# EAGLE design quad_train_detector (EAGLE 4.16)
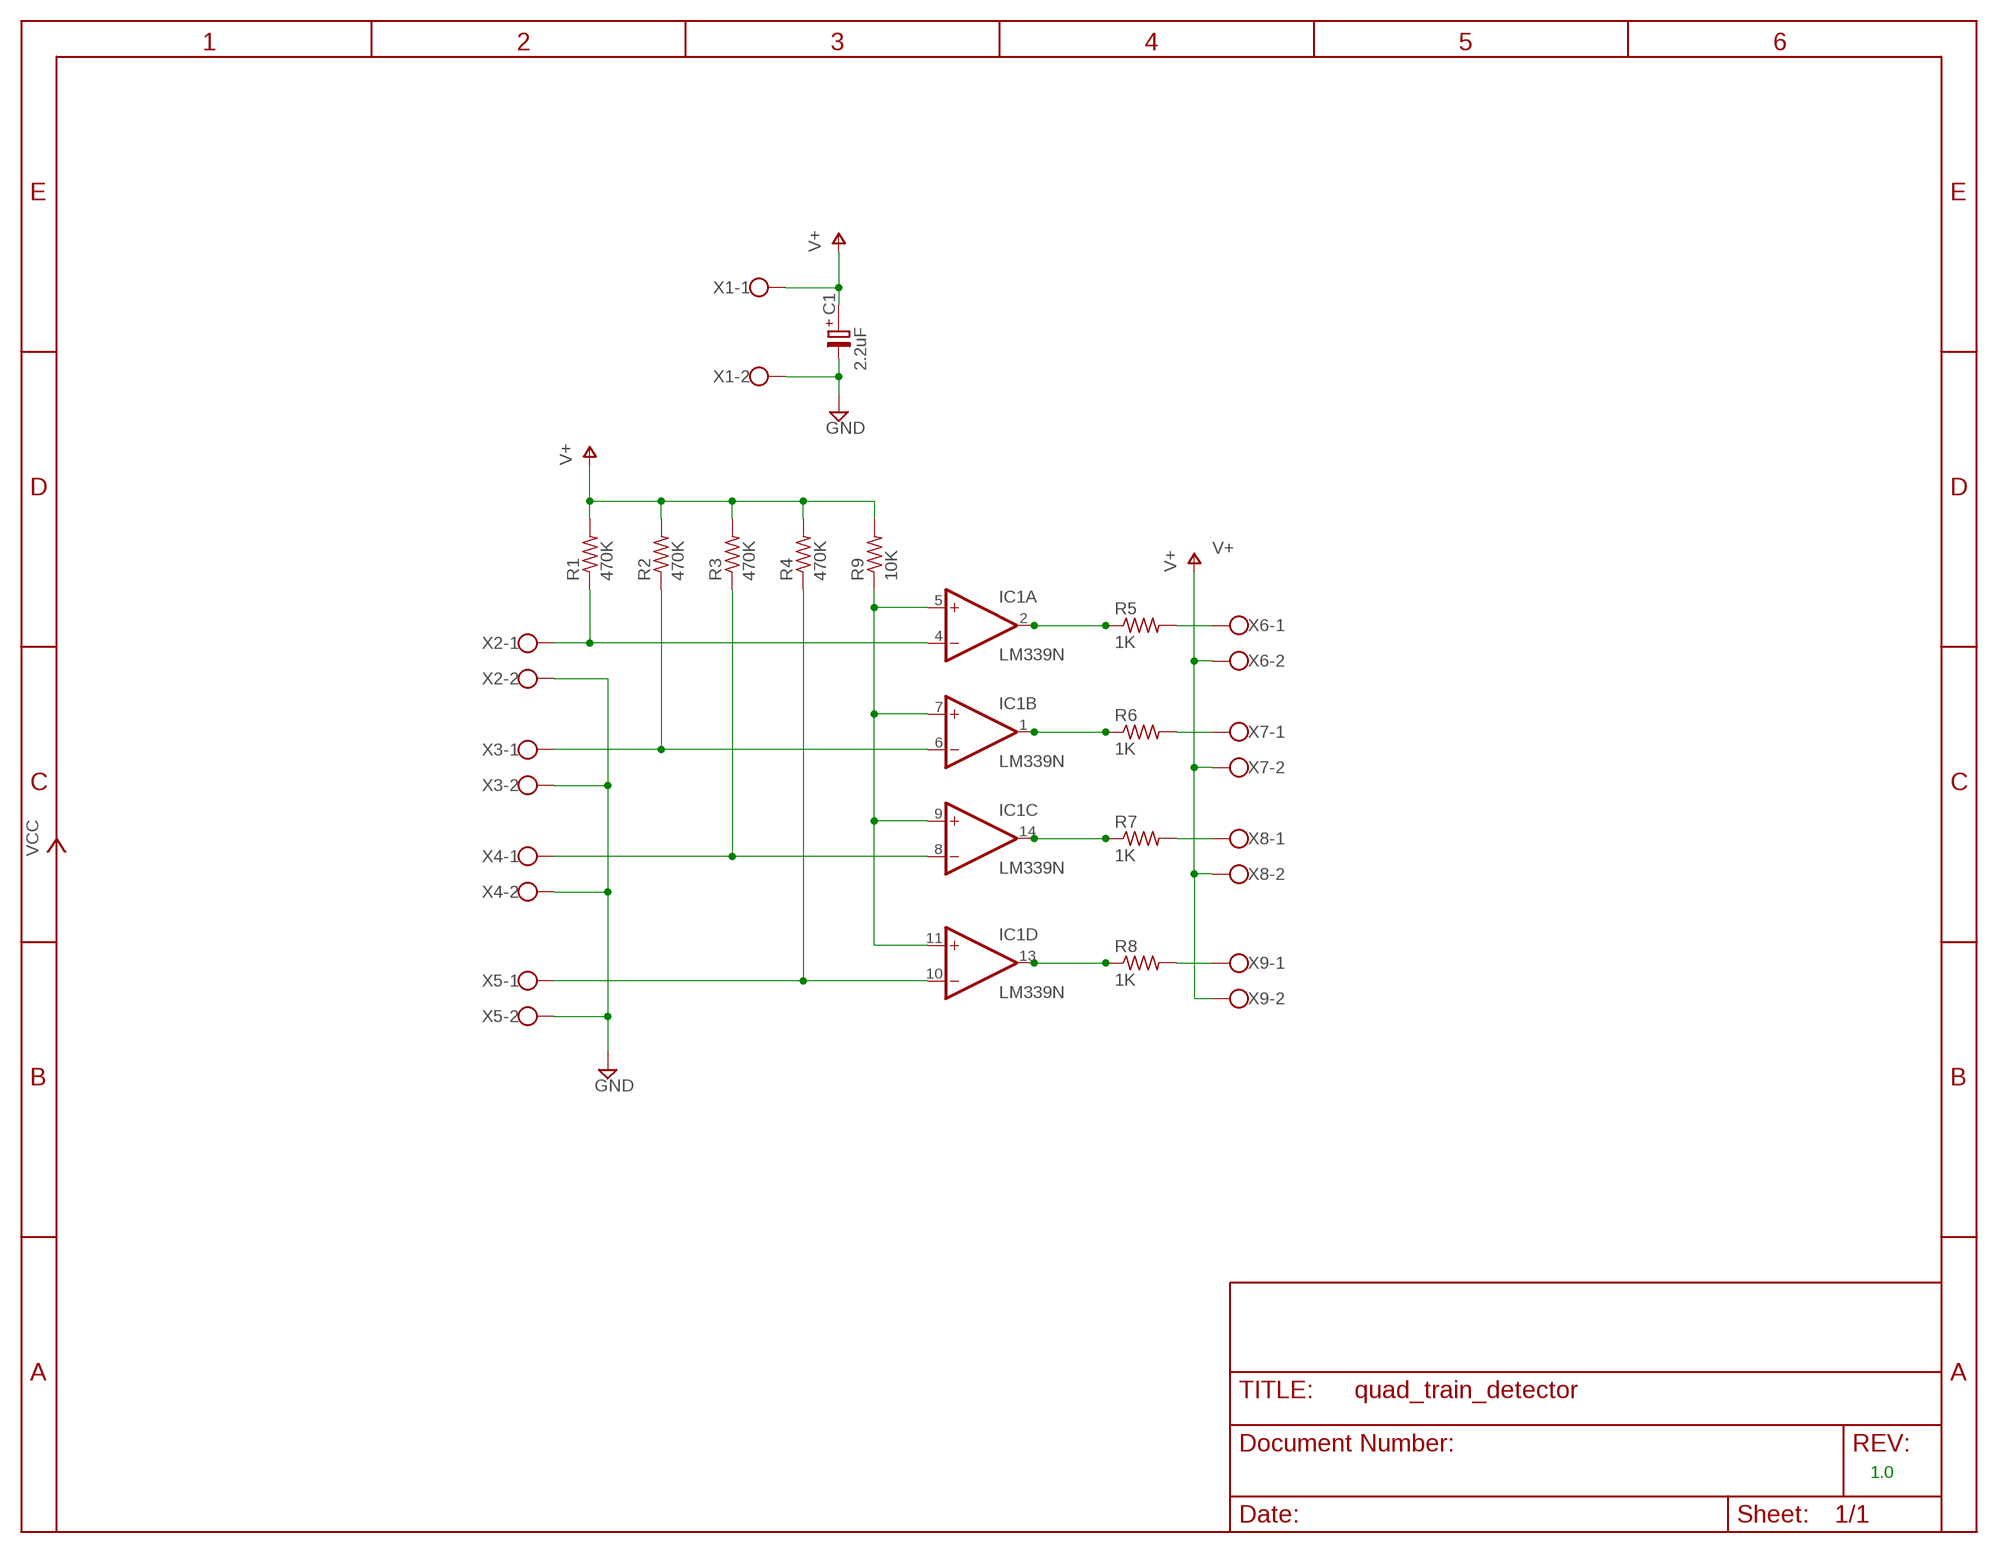
[diagram p0: schematic, sheet 1]

## Parts
C1  2.2uF  C-PR-2,0X5  [E2,0-5]
IC1  LM339N  [DIL14]
R1  470K  R-US_0207/10  [0207/10]
R2  470K  R-US_0207/10  [0207/10]
R3  470K  R-US_0207/10  [0207/10]
R4  470K  R-US_0207/10  [0207/10]
R5  1K  R-US_0207/10  [0207/10]
R6  1K  R-US_0207/10  [0207/10]
R7  1K  R-US_0207/10  [0207/10]
R8  1K  R-US_0207/10  [0207/10]
R9  10K  R-US_0207/10  [0207/10]
X1  AK550/2  [AK550/2]
X2  AK550/2  [AK550/2]
X3  AK550/2  [AK550/2]
X4  AK550/2  [AK550/2]
X5  AK550/2  [AK550/2]
X6  AK550/2  [AK550/2]
X7  AK550/2  [AK550/2]
X8  AK550/2  [AK550/2]
X9  AK550/2  [AK550/2]

## Nets
GND: C1.- X1.2 X2.2 X3.2 X4.2 X5.2
N$1: IC1.5(A:+IN) IC1.7(B:+IN) IC1.9(C:+IN) IC1.11(D:+IN) R9.1
N$2: R8.2 X9.1
N$3: IC1.4(A:-IN) R1.1 X2.1
N$4: IC1.6(B:-IN) R2.1 X3.1
N$5: IC1.8(C:-IN) R3.1 X4.1
N$6: IC1.10(D:-IN) R4.1 X5.1
N$7: R7.2 X8.1
N$8: IC1.2(A:OUT) R5.1
N$9: IC1.1(B:OUT) R6.1
N$10: IC1.14(C:OUT) R7.1
N$11: IC1.13(D:OUT) R8.1
N$12: R5.2 X6.1
N$14: R6.2 X7.1
V+: C1.+ R1.2 R2.2 R3.2 R4.2 R9.2 X1.1 X6.2 X7.2 X8.2 X9.2

## Notes on the sheet
- 1.0

## Power pins joined to a net without a drawn wire
GND: IC1.12(P:GND)
V+: IC1.3(P:V+)

## Library data of the parts
C1 = cap-pan40:C-PR: POLARIZED ELECTROLYTIC/TANTALUM
IC1 = linear:LM339: Low Power Low Offset Voltage Quad Comparators with open collector; LM139/LM239/LM339/LM2901/LM3302
R1-R9 = rcl:R-US_: RESISTOR, American symbol
X1-X9 = con-ptr500+:AK550/2: CONNECTOR

## Board
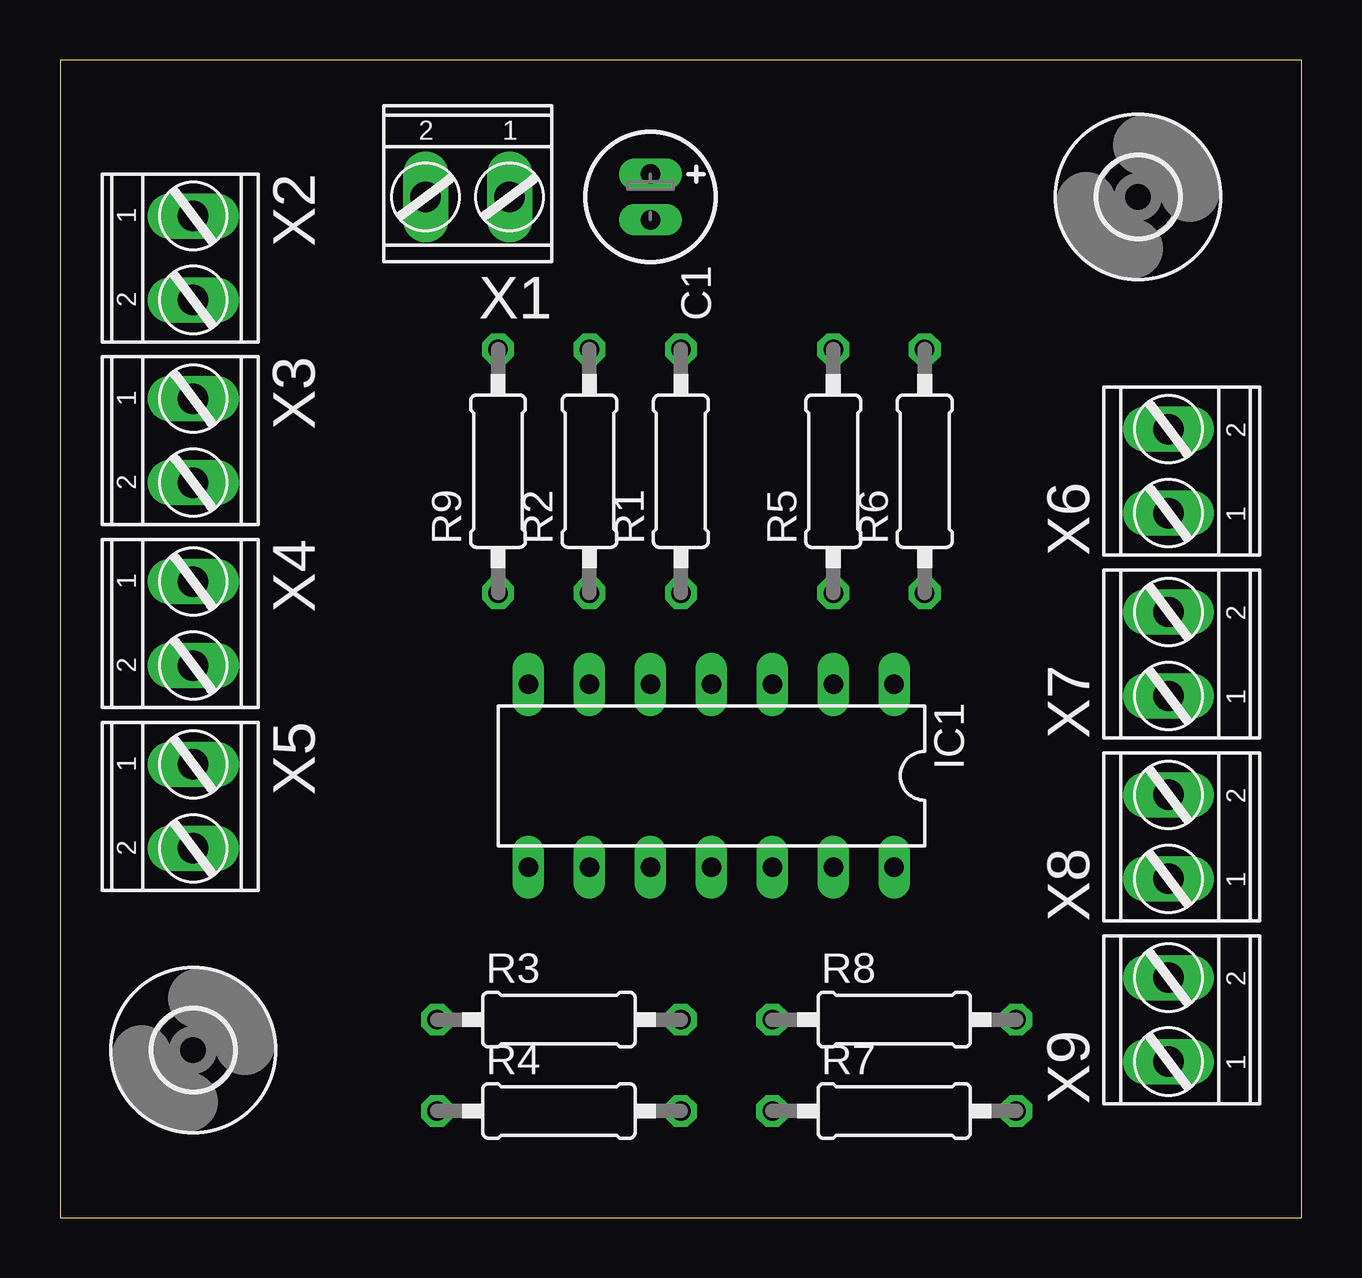
[diagram p1: board, top side]
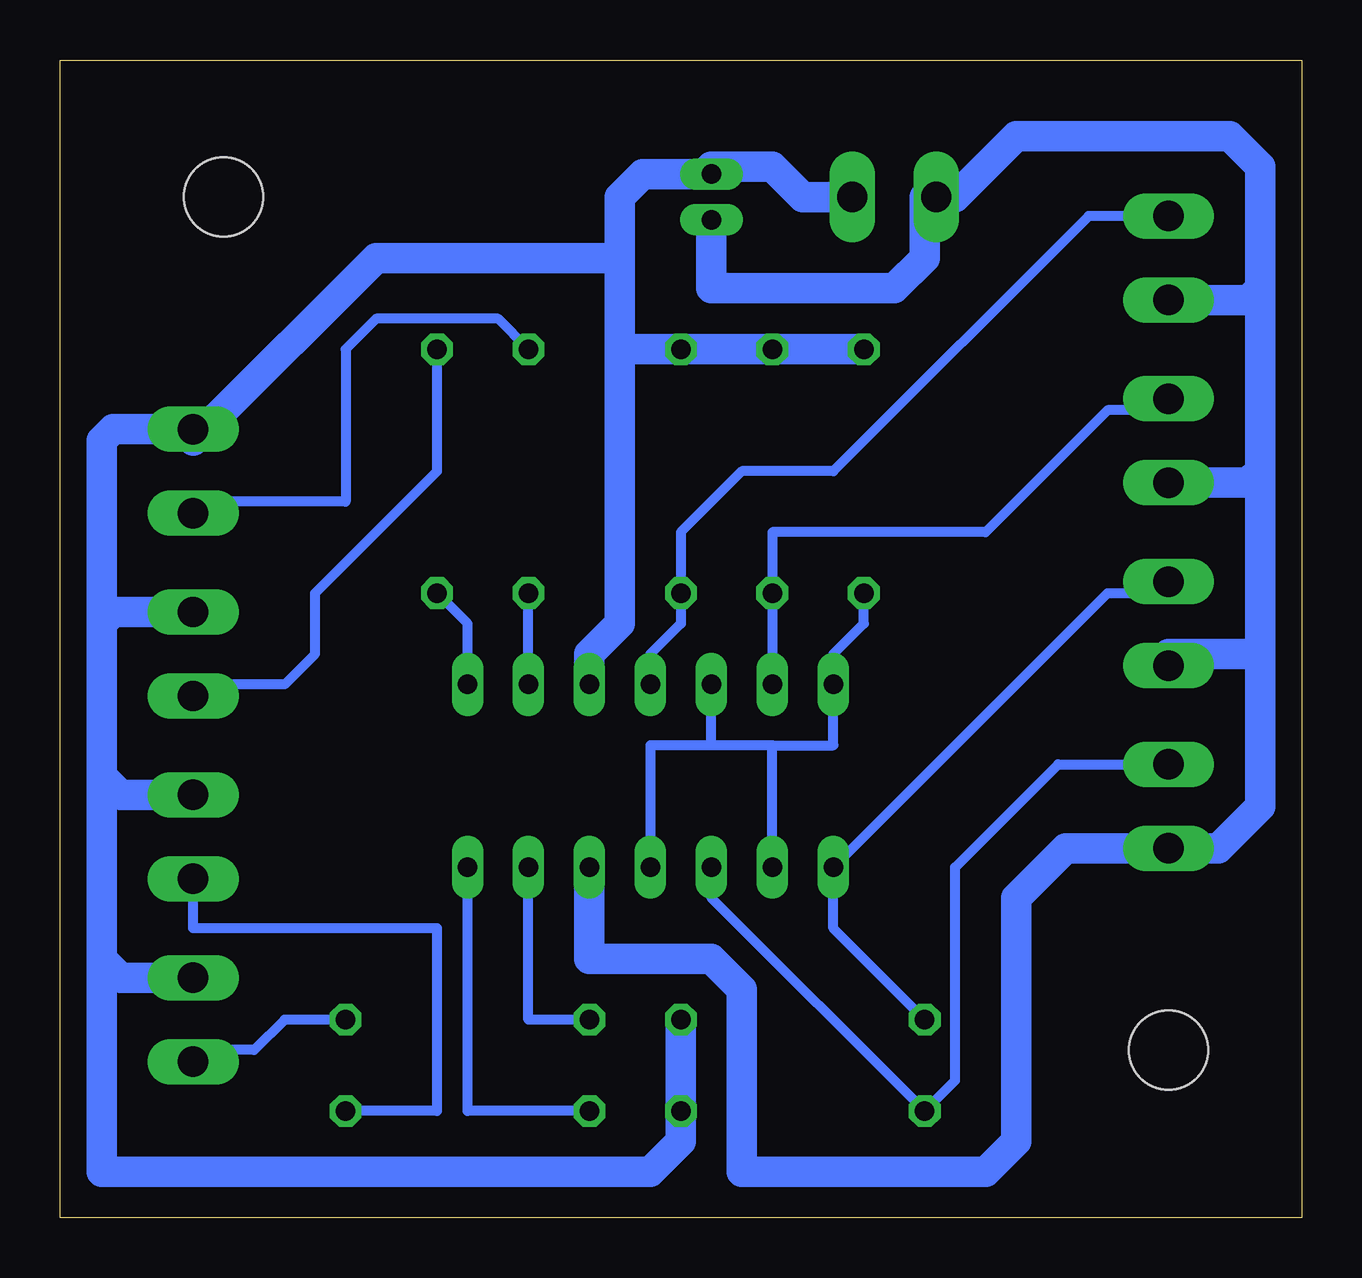
[diagram p2: board, bottom side, seen from below]

Size 51.74 x 48.25 mm. Coordinates in mm from the lower left corner, seen from the top.
Outline: 0,0 51.74,0 51.74,48.25 0,48.25 0,0
Copper layers (1*16): Top 0.035mm / dielectric 1.5mm / Bottom 0.035mm
Design rules "default": minimum track width 10mil, minimum drill 24mil, track to track 8mil, track to pad 8mil, pad to pad 8mil, via to via 8mil, smd to smd 8mil, copper to edge 40mil, drill to drill 8mil, minimum pad ring 10mil, minimum via ring 8mil, stop-mask expansion 4mil, vias tented up to drill 0mil, thermal gap 10mil

### Footprints (pad centres in the part's own frame; a part is rotated, then mirrored left to right if it is on the bottom)
E2,0-5 = drill 0.813 long: + -0.953,0; - 0.953,0
DIL14 = drill 0.813 long: 1 -7.62,-3.81; 2 -5.08,-3.81; 3 -2.54,-3.81; 4 0,-3.81; 5 2.54,-3.81; 6 5.08,-3.81; 7 7.62,-3.81; 8 7.62,3.81; 9 5.08,3.81; 10 2.54,3.81; 11 0,3.81; 12 -2.54,3.81; 13 -5.08,3.81; 14 -7.62,3.81
0207/10 = drill 0.813 octagon: 1 -5.08,0; 2 5.08,0
3,3 = hole 3.3: 0,0
AK550/2 = drill 1.27 long: 1 -1.75,0; 2 1.75,0

### Placement (x,y rotation side)
C1  24.6,42.54 270 top
IC1  27.14,18.41 180 top
R1  25.87,31.11 90 top
R2  22.06,31.11 90 top
R3  20.79,8.25 0 top
R4  20.79,4.44 0 top
R5  32.22,31.11 90 top
R6  36.03,31.11 90 top
R7  34.76,4.44 0 top
R8  34.76,8.25 0 top
R9  18.25,31.11 90 top
U$1  [3,3]  5.55,6.98 0 top
U$4  [3,3]  44.92,42.54 0 top
X1  16.98,42.54 180 top
X2  5.55,40 270 top
X3  5.55,32.38 270 top
X4  5.55,24.76 270 top
X5  5.55,17.14 270 top
X6  46.19,31.11 90 top
X7  46.19,23.49 90 top
X8  46.19,15.87 90 top
X9  46.19,8.25 90 top

### Tracks (layer width: path | path; a pad name or v marks a point on that pad's centre or on a via)
GND
  Bottom 1.27: 1.74,23.49 1.74,17.14 3.49,15.39 X5.2 9.84,15.39 11.9,13.33 11.9,3.17 13.17,1.9 23.33,1.9 23.33,9.52 24.6,10.79 29.68,10.79 IC1.12 | 1.74,23.49 1.74,31.11 | 1.74,31.11 1.74,38.73 | X4.2 5.55,23.49 1.74,23.49 | X3.2 2.22,30.63 1.74,31.11 | X2.2 2.22,38.25 1.74,38.73 | 1.74,38.73 1.74,43.81 3.01,45.08 11.9,45.08 14.44,42.54 X1.2 15.71,42.54 15.71,40 16.98,38.73 24.6,38.73 C1.-
N$1
  Bottom 0.406: R9.1 18.25,24.76 19.52,23.49 IC1.7 19.52,19.68 22.06,19.68 | 22.06,19.68 24.6,19.68 | 24.6,19.68 IC1.5 | IC1.9 22.06,19.68 | IC1.11 27.14,19.68 24.6,19.68
N$2
  Bottom 0.406: R8.2 42.38,8.25 43.65,6.98 46.19,6.98 X9.1
N$3
  Bottom 0.406: IC1.4 27.14,23.49 25.87,24.76 R1.1 25.87,28.57 23.33,31.11 19.52,31.11 8.88,41.75 X2.1
N$4
  Bottom 0.406: IC1.6 R2.1 22.06,28.57 13.17,28.57 8.09,33.65 5.55,33.65 X3.1
N$5
  Bottom 0.406: R3.1 19.52,12.06 IC1.8 8.09,26.03 5.55,26.03 X4.1
N$6
  Bottom 0.406: X5.1 10.15,18.89 14.44,14.6 14.44,5.71 R4.1 24.6,13.33 IC1.10
N$7
  Bottom 0.406: R7.2 36.03,4.44 36.03,12.06 46.19,12.06 X8.1 46.19,14.6
N$8
  Bottom 0.406: IC1.2 R5.1
N$9
  Bottom 0.406: IC1.1 34.76,24.76 R6.1
N$10
  Bottom 0.406: IC1.14 34.76,4.44 R7.1
N$11
  Bottom 0.406: R8.1 32.22,8.25 IC1.13
N$12
  Bottom 0.406: X6.1 46.19,29.84 39.84,29.84 39.84,36.19 38.57,37.46 33.49,37.46 R5.2
N$14
  Bottom 0.406: R6.2 36.03,31.11 41.11,26.03 41.11,23.49 42.38,22.22 46.19,22.22 | 46.19,22.22 X7.1 | 46.19,22.22 47.46,22.22
V+
  Bottom 1.27: 50,10.79 50,18.41 | 50,18.41 50,24.76 | 50,24.76 50,32.38 49.52,32.86 46.67,32.86 46.19,32.38 X6.2 45.71,32.86 38.57,40 28.41,40 | X9.2 49.21,10 50,10.79 | X7.2 49.52,25.24 50,24.76 | X8.2 49.21,17.62 50,18.41 | R9.2 R2.2 R1.2 28.41,36.19 | 28.41,36.19 28.41,24.76 29.68,23.49 IC1.3 | R3.2 R4.2 25.87,3.17 27.14,1.9 50,1.9 50,10.79 | X1.1 20.79,42.54 22.06,43.81 24.6,43.81 C1.+ 27.46,43.49 28.41,42.54 28.41,40 | 28.41,40 28.41,36.19